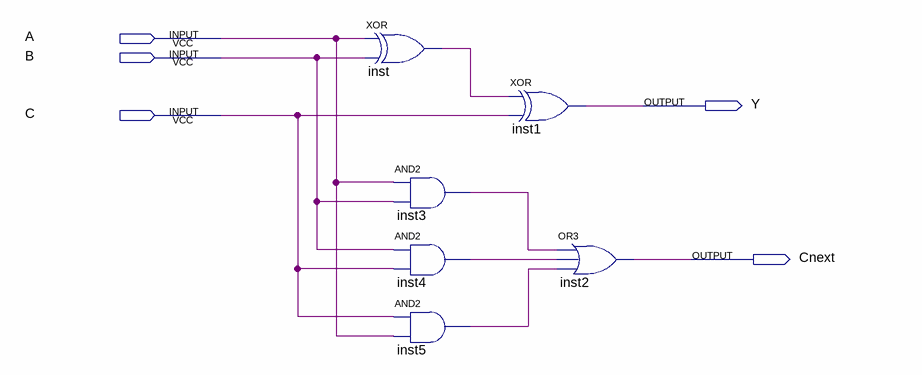
[diagram p0: schematic sheet]
// Quartus schematic Sum.bdf as structural Verilog: 6 symbols, 5 pins
module Sum (
  input  A,
  input  B,
  input  C,
  output Y,
  output Cnext
);

  wire inst3_out, inst4_out, inst5_out, inst_out;

  xor inst (inst_out, A, B);
  and inst3 (inst3_out, A, B);
  and inst4 (inst4_out, B, C);
  and inst5 (inst5_out, C, A);
  xor inst1 (Y, inst_out, C);
  or inst2 (Cnext, inst3_out, inst4_out, inst5_out);
endmodule
